# Altium schematic sheet Complete Overview.SchDoc
size A4; DocumentNumber: 1; SheetNumber: 1; SheetTotal: 12
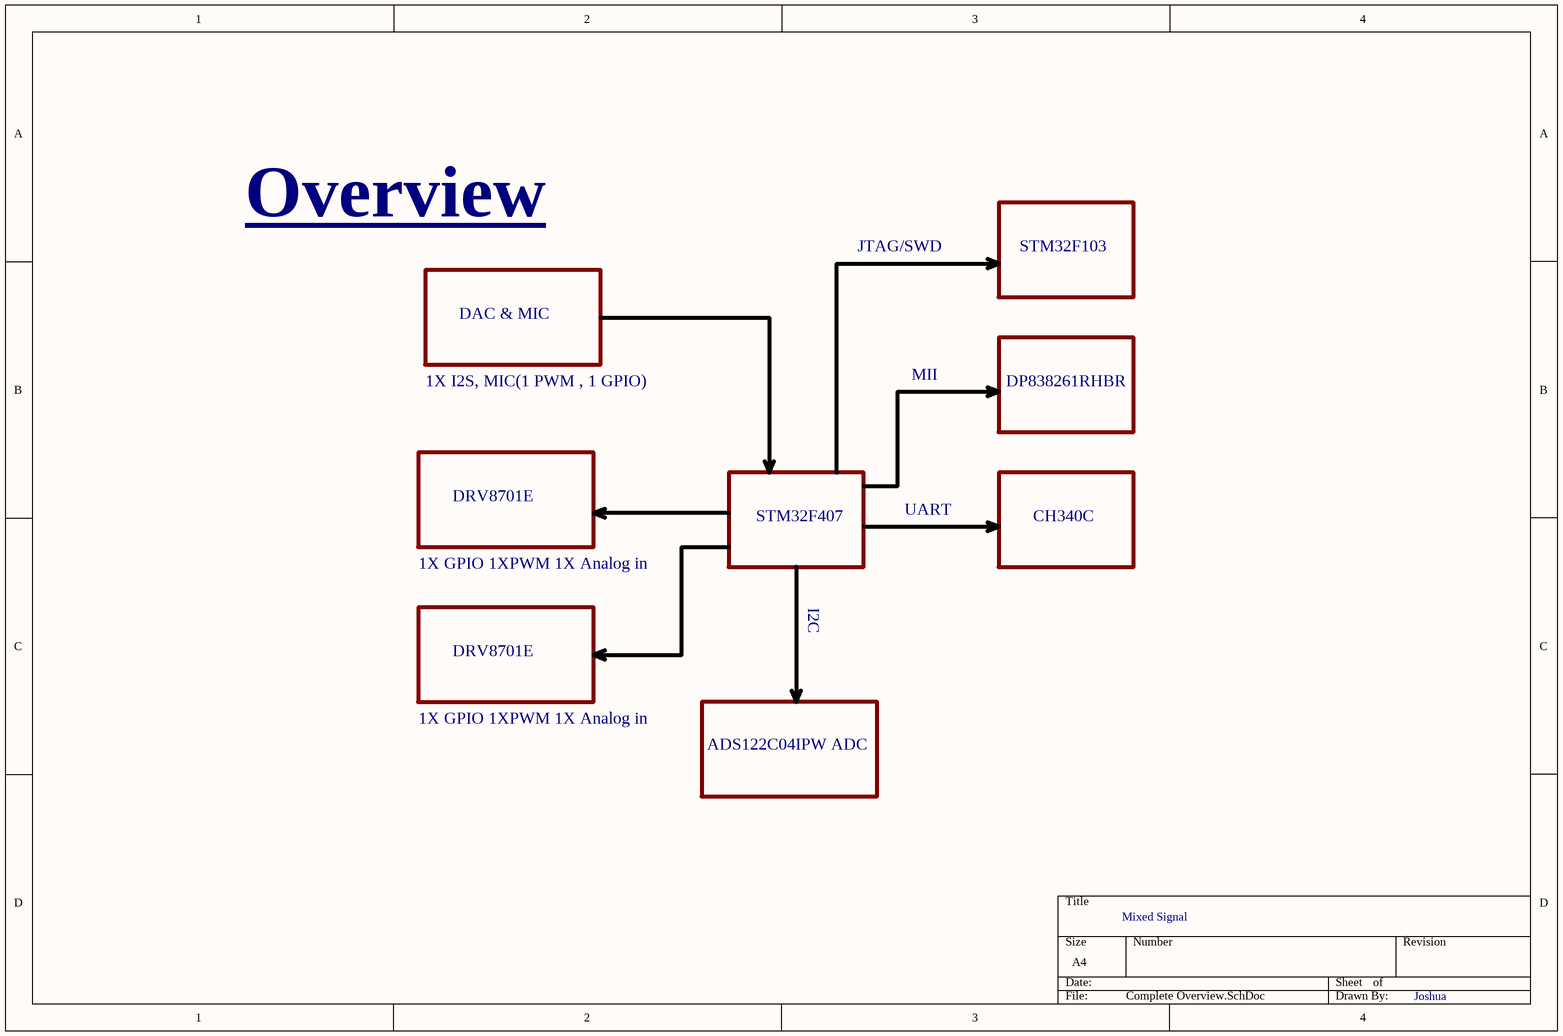
[diagram p0: Complete Overview.SchDoc]

## Notes on the sheet
- Overview
- JTAG/SWD
- STM32F103
- DAC & MIC
- MII
- 1X I2S, MIC(1 PWM , 1 GPIO)
- DP838261RHBR
- DRV8701E
- UART
- 1X GPIO 1XPWM 1X Analog in
- STM32F407
- CH340C
- I2C
- ADS122C04IPW ADC
- Mixed Signal
- Joshua